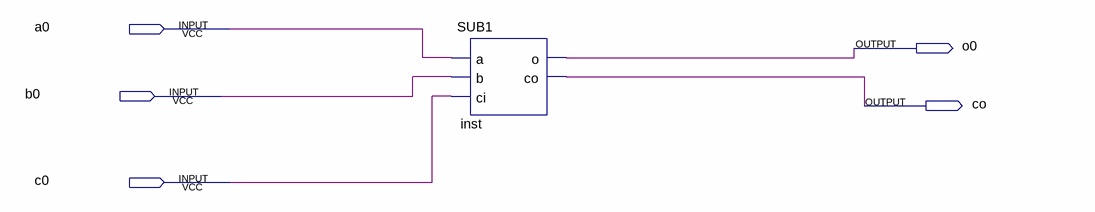
[diagram p0: schematic sheet]
// Quartus schematic SubTest.bdf as structural Verilog: 1 symbols, 5 pins
module SubTest (
  input  a0,
  input  b0,
  input  c0,
  output o0,
  output co
);

  SUB1 inst (.a(a0), .b(b0), .ci(c0), .o(o0), .co(co));
endmodule
